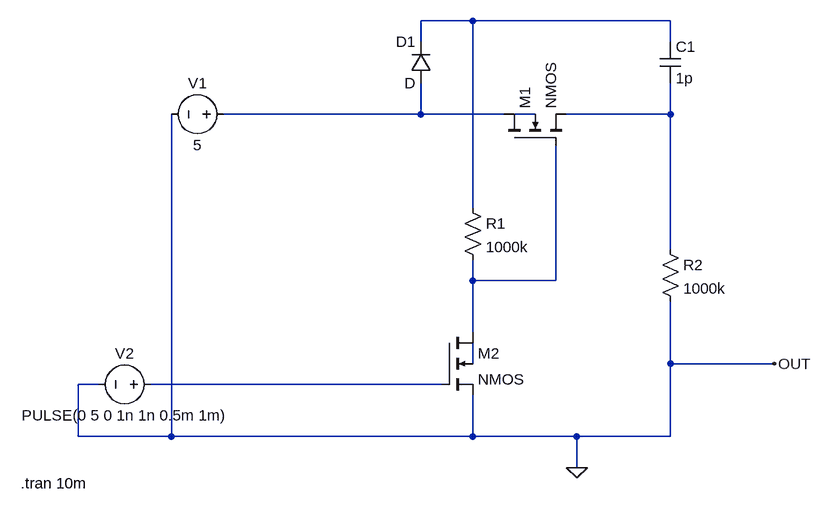
[diagram p0: schematic bootstrap_nmos.asc]
bootstrap_nmos.asc, the LTspice schematic file:
Version 4
SHEET 1 880 680
WIRE 144 -48 64 -48
WIRE 448 -48 144 -48
WIRE 64 -16 64 -48
WIRE 448 -16 448 -48
WIRE 64 96 64 48
WIRE 64 96 -240 96
WIRE 192 96 64 96
WIRE 240 96 208 96
WIRE 448 96 448 48
WIRE 448 96 288 96
WIRE 144 240 144 -48
WIRE 448 304 448 96
WIRE 144 352 144 320
WIRE 272 352 272 144
WIRE 272 352 144 352
WIRE 144 432 144 352
WIRE 144 480 144 448
WIRE 448 480 448 384
WIRE 608 480 448 480
WIRE -432 512 -464 512
WIRE 96 512 -352 512
WIRE -464 592 -464 512
WIRE -320 592 -320 96
WIRE -320 592 -464 592
WIRE 144 592 144 528
WIRE 144 592 -320 592
WIRE 304 592 144 592
WIRE 448 592 448 480
WIRE 448 592 304 592
WIRE 304 640 304 592
FLAG 304 640 0
FLAG 608 480 OUT
SYMBOL nmos4 192 144 R270
SYMATTR InstName M1
SYMBOL nmos4 96 432 R0
SYMATTR InstName M2
SYMBOL diode 80 48 R180
WINDOW 0 24 64 Left 2
WINDOW 3 24 0 Left 2
SYMATTR InstName D1
SYMBOL cap 432 -16 R0
SYMATTR InstName C1
SYMATTR Value 1p
SYMBOL res 128 224 R0
SYMATTR InstName R1
SYMATTR Value 1000k
SYMBOL res 432 288 R0
SYMATTR InstName R2
SYMATTR Value 1000k
SYMBOL voltage -224 96 R90
WINDOW 0 -32 56 VBottom 2
WINDOW 3 32 56 VTop 2
WINDOW 123 0 0 Left 0
WINDOW 39 0 0 Left 0
SYMATTR InstName V1
SYMATTR Value 5
SYMBOL voltage -336 512 R90
WINDOW 0 -32 56 VBottom 2
WINDOW 3 32 56 VTop 2
WINDOW 123 0 0 Left 0
WINDOW 39 0 0 Left 0
SYMATTR InstName V2
SYMATTR Value PULSE(0 5 0 1n 1n 0.5m 1m)
TEXT -552 664 Left 2 !.tran 10m

The netlist it stands for:
* bootstrap_nmos.asc
M1 N002 N005 N004 N003 NMOS
M2 N005 N007 0 N006 NMOS
D1 N002 N001 D
C1 N001 N004 1p
R1 N001 N005 1000k
R2 N004 0 1000k
V1 N002 0 5
V2 N007 0 PULSE(0 5 0 1n 1n 0.5m 1m)
.model D D
.lib standard.dio
.model NMOS NMOS
.model PMOS PMOS
.lib standard.mos
.tran 10m
.backanno
.end